# Altium schematic sheet Cell.SchDoc
size B; DocumentNumber: 6; SheetNumber: 6; SheetTotal: 14; PAGE_TITLE: -
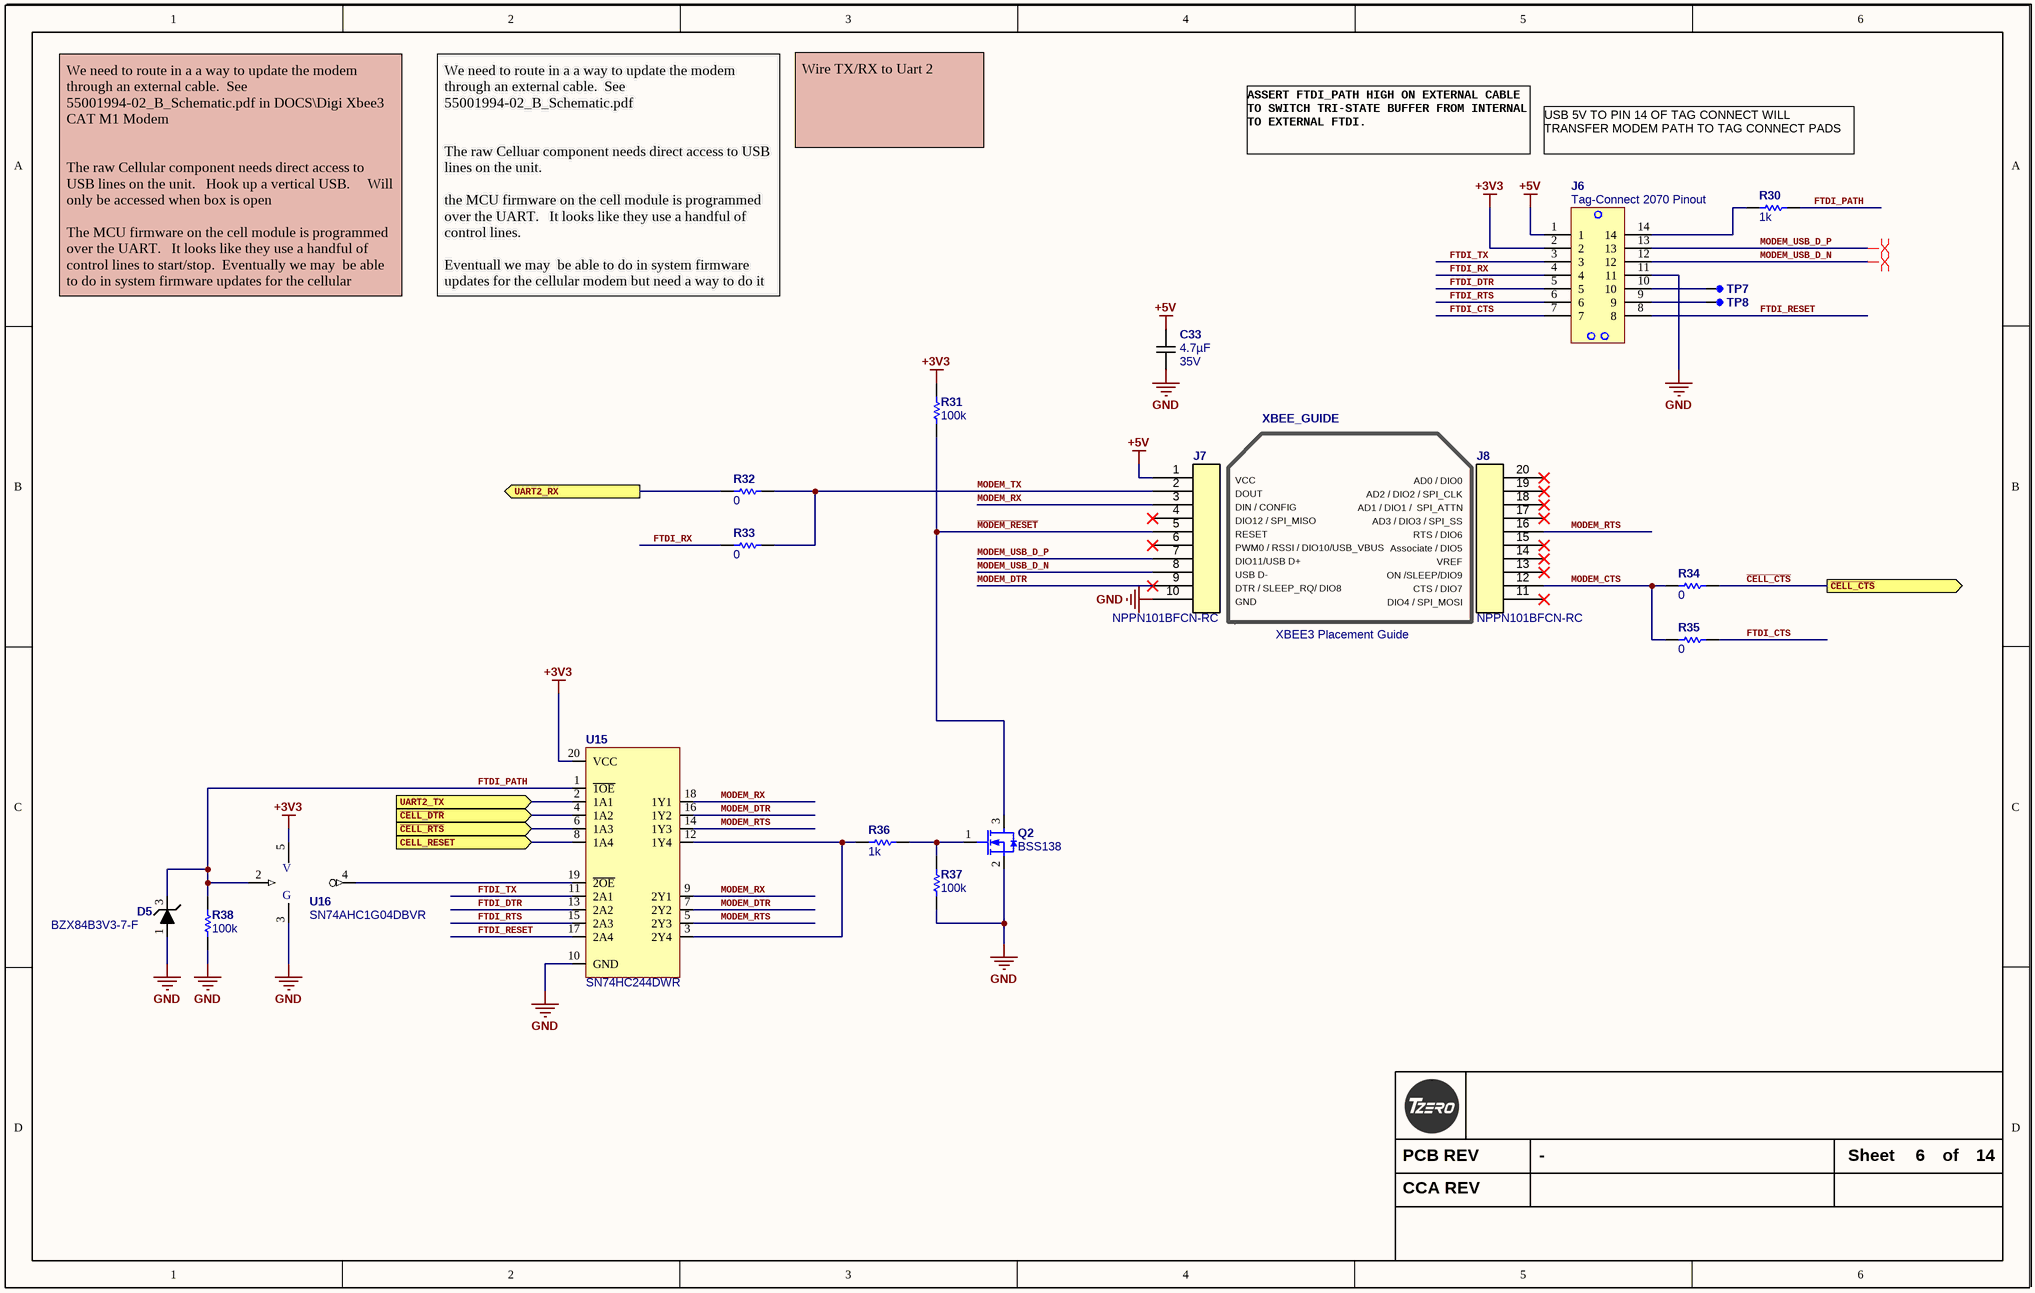
[diagram p0: Cell.SchDoc]

## Parts
C33  4.7µF  Voltage - Rated: 35V  [C0805_1.50MM_HD]
D5  BZX84B3V3-7-F  [D_SOT-23-3_P]
J6  Tag-Connect 2070 Pinout  [TC2070]  (no BOM)
J7  NPPN101BFCN-RC  [NPPN101BFCN-RC]
J8  NPPN101BFCN-RC  [NPPN101BFCN-RC - 11-20]
Q2  BSS138  [SOT23_Medium]
R30  1k  [R0603_0.55MM_MD]
R31  100k  [R0603_0.55MM_MD]
R32  0  [R0603_0.55MM_MD]
R33  0  [R0603_0.55MM_MD]
R34  0  [R0603_0.55MM_MD]
R35  0  [R0603_0.55MM_MD]
R36  1k  [R0603_0.55MM_MD]
R37  100k  [R0603_0.55MM_MD]
R38  100k  [R0603_0.55MM_MD]
TP7  (no value)  [TP_SMT_25_MIL_ROUND]  (net tie, no BOM)
TP8  (no value)  [TP_SMT_25_MIL_ROUND]  (net tie, no BOM)
U15  SN74HC244DWR  [SOIC-20-300_MEDIUM]
U16  SN74AHC1G04DBVR  [TSOT-23-5]
XBEE_GUIDE  XBEE3 Placement Guide  [XBEE3_CELLULAR_PLACEMENT_GUIDE]  (no BOM)

## Ports
CELL_RESET (in), UART2_RX (out), UART2_TX (in), ~{CELL_CTS} (out), ~{CELL_DTR} (in), ~{CELL_RTS} (in)

## Nets
+3V3: J6.2 R31.2 U15.20(VCC) U16.5(VCC)
+5V: C33.2 J6.1 J7.1
GND: C33.1 D5.1(A) J6.11 J7.10 Q2.2(S) R37.1 R38.1 U15.10(GND) U16.3(GND)
~{CELL_CTS}: R34.1 ; port ~{CELL_CTS}
~{CELL_DTR}: U15.4(1A2) ; port ~{CELL_DTR}
~{CELL_RTS}: U15.6(1A3) ; port ~{CELL_RTS}
~{MODEM_RESET}: J7.5 Q2.3(D) R31.1
CELL_RESET: U15.8(1A4) ; port CELL_RESET
FTDI_CTS: J6.7 R35.1
FTDI_DTR: J6.5 U15.13(2A2)
FTDI_PATH: D5.3(K) R30.1 R38.2 U15.1(~{1OE}) U16.2(A)
FTDI_RESET: J6.8 U15.17(2A4)
FTDI_RTS: J6.6 U15.15(2A3)
FTDI_RX: J6.4 R33.2
FTDI_TX: J6.3 U15.11(2A1)
MODEM_CTS: J8.12 R34.2 R35.2
MODEM_DTR: J7.9 U15.7(2Y2) U15.16(1Y2)
MODEM_RTS: J8.16 U15.5(2Y3) U15.14(1Y3)
MODEM_RX: J7.3 U15.9(2Y1) U15.18(1Y1)
MODEM_TX: J7.2 R32.1 R33.1
MODEM_USB_D_N: J6.12 J7.8
MODEM_USB_D_P: J6.13 J7.7
UART2_RX: R32.2 ; port UART2_RX
UART2_TX: U15.2(1A1) ; port UART2_TX
NetJ6_9: J6.9 TP8.1
NetJ6_10: J6.10 TP7.1
NetJ6_14: J6.14 R30.2
NetQ2_1: Q2.1(G) R36.1 R37.2
NetR36_2: R36.2 U15.3(2Y4) U15.12(1Y4)
NetU15_19: U15.19(~{2OE}) U16.4(Y)

Not connected (* = marked no-connect by the designer): J7 4* 6*; J8 11* 13* 14* 15* 17* 18* 19* 20*

## Layout directives
differential pair; differential pair class DIFF90: MODEM_USB_D_N, MODEM_USB_D_P

## Notes on the sheet
- Wire TX/RX to Uart 2
- ASSERT FTDI_PATH HIGH ON EXTERNAL CABLE TO SWITCH TRI-STATE BUFFER FROM INTERNAL TO EXTERNAL FTDI.
- USB 5V TO PIN 14 OF TAG CONNECT WILL TRANSFER MODEM PATH TO TAG CONNECT PADS
- We need to route in a a way to update the modem through an external cable.  See 55001994-02_B_Schematic.pdf in DOCS\Digi Xbee3 CAT M1 Modem
  The raw Cellular component needs direct access to USB lines on the unit.   Hook up a vertical USB.     Will only be accessed when box is open
  The MCU firmware on the cell module is programmed over the UART.   It looks like they use a handful of control lines to start/stop.  Eventually we may  be able to do in system firmware updates for the cellular modem but need a way to do it manually without pulling the modem out of the socket.   I would like to have some sort of "mux" that routes the UART and control signals to an external connector.    We could also put another FTDI chip on the PCB but it would rarely be used.    Can't use a stanard FTDI cable as we weel RTS,CTS and DTR.
- We need to route in a a way to update the modem through an external cable.  See 55001994-02_B_Schematic.pdf
  The raw Celluar component needs direct access to USB lines on the unit.
  the MCU firmware on the cell module is programmed over the UART.   It looks like they use a handful of control lines.
  Eventuall we may  be able to do in system firmware updates for the cellular modem but need a way to do it manually without pulling the modem out of the socket
- PCB REV
- Sheet
- of
- CCA REV
- (in symbol SN74AHC1G04DBVR) V; G
- (in symbol XBEE3_CELLULAR_PLACEMENT_GUIDE) AD0 / DIO0; VCC; AD2 / DIO2 / SPI_CLK; DOUT; AD1 / DIO1 /  SPI_ATTN; DIN / CONFIG; AD3 / DIO3 / SPI_SS; DIO12 / SPI_MISO; RTS / DIO6; RESET; Associate / DIO5; PWM0 / RSSI / DIO10/USB_VBUS; VREF; DIO11/USB D+; ON /SLEEP/DIO9; USB D-; CTS / DIO7; DTR / SLEEP_RQ/ DIO8; DIO4 / SPI_MOSI; GND

## Library data of the parts
C33 = CGA4J1X7R1V475K125AE: CAP CER 4.7UF 35V X7R 0805; Manufacturer: TDK Corporation; Tolerance: ±10%; Substitution Notes: 4.7µF , 35V , ±10% , X7R , -55°C ~ 125°C , AEC-Q200 , 0805; Value: 4.7µF; Temperature Coefficient: X7R; Manufacturer Part Number: CGA4J1X7R1V475K125AE; ComponentLink1Description: Datasheet (Internal); ComponentLink1URL: datasheets\TDK\mlcc_automotive_general_en.pdf; ComponentLink2Description: Datasheet (External); ComponentLink2URL: https://product.tdk.com/info/en/catalog/datasheets/mlcc_automotive_general_en.pdf; Supplier 1: Digikey; Supplier Part Number 1: 445-172479-1-ND; Category: Capacitors; Features: Soft Termination; Operating Temperature: -55°C ~ 125°C; Ratings: AEC-Q200; Package: 0805; Thickness (Max): 1.50MM
D5 = BZX84B3V3-7-F: DIODE ZENER 3.3V 300MW SOT23; Manufacturer: Diodes Inc; CategorySort: 400; Voltage - Forward (Vf) (Max) @ If: 900mV @ 10mA; Current - Reverse Leakage @ Vr: 5µA @ 1V; Tolerance: ±2%; Impedance (Max) (Zzt): 95 Ohm; Num Pins: 3; Diode Suffix: 1A_3C; Library Ref ARL: ARL_DZ_1A_3C; Category: Diodes; Value: BZX84B3V3-7-F; Manufacturer Part Number: BZX84B3V3-7-F; ComponentLink1Description: Internal Datasheet; ComponentLink1URL: http://www.diodes.com/datasheets/BZX84Bxx(x).pdf; ComponentLink2Description: External Datasheet; ComponentLink2URL: http://www.diodes.com/datasheets/BZX84Bxx(x).pdf; Stocked: 0; Supplier 1: Digi-Key; Supplier Part Number 1: BZX84B3V3-FDICT-ND; SortValue: BZX84B3V3-7-F; Pricing: 1 = 0.19  ;  10 = 0.177  ;  25 = 0.1612  ;  100 = 0.1159  ;  250 = 0.06824  ;  500 = 0.05662  ;  1000 = 0.03863 (USD); Sales Status: Active; Voltage - Zener (Nom) (Vz): 3.3V; Power - Max: 300mW; Mounting Type: Surface Mount; Package: TO-236-3- SC-59- SOT-23-3; Supplier Device Package: SOT-23-3; Packaging: Cut Tape (CT); Operating Temperature: -65°C ~ 150°C; MANUFACTURER_P_N: BZX84B3V3-7-F
J6 = TC2070
J7 = NPPN101BFCN-RC: CONN RECEPT 2MM SINGLE STR 10POS; Manufacturer: Sullins; Number of Positions: 10; Connector Type: Header,Socket; Current Rating: 1A; Gender: Female; Insulation Resistance: 5GR; Pitch: 0.079inch; Value: NPPN101BFCN-RC; Supplier 1: Digi-Key; Supplier Part Number 1: S5751-10-ND; Manufacturer Part Number: NPPN101BFCN-RC; RoHS: Yes; Stock: 72438; Pricing: 1 = 0.98000, 60 = 0.78033, 120 = 0.74650, 540 = 0.61074, 1020 = 0.54288, 5040 = 0.49010 (USD); Mount: Through Hole; Colour: Black; Contact Plating: Gold; Contact Material: Bronze; Material: Nylon; Min Operating Temperature: -40°C; Max Operating Temperature: 105°C; Package Quantity: 1000; Number of Rows: 1; Packaging: Bulk; Termination: Solder; Lead Free: Lead Free; ComponentLink1URL: https://drawings-pdf.s3.amazonaws.com/10483.pdf; ComponentLink1Description: https://drawings-pdf.s3.amazonaws.com/10483.pdf
J8 = NPPN101BFCN-RC_11-20: CONN RECEPT 2MM SINGLE STR 10POS; Manufacturer: Sullins; Number of Positions: 10; Connector Type: Header,Socket; Current Rating: 1A; Gender: Female; Insulation Resistance: 5GR; Pitch: 0.079inch; Value: NPPN101BFCN-RC; Supplier 1: Digi-Key; Supplier Part Number 1: S5751-10-ND; Manufacturer Part Number: NPPN101BFCN-RC; RoHS: Yes; Stock: 72438; Pricing: 1 = 0.98000, 60 = 0.78033, 120 = 0.74650, 540 = 0.61074, 1020 = 0.54288, 5040 = 0.49010 (USD); Mount: Through Hole; Colour: Black; Contact Plating: Gold; Contact Material: Bronze; Material: Nylon; Min Operating Temperature: -40°C; Max Operating Temperature: 105°C; Package Quantity: 1000; Number of Rows: 1; Packaging: Bulk; Termination: Solder; Lead Free: Lead Free; ComponentLink1URL: https://drawings-pdf.s3.amazonaws.com/10483.pdf; ComponentLink1Description: https://drawings-pdf.s3.amazonaws.com/10483.pdf
Q2 = BSS138: FAIRCHILD SEMICONDUCTOR - BSS138 - N CHANNEL MOSFET, 50V, 220mA SOT-23; CategorySort: 500; Value: BSS138; Sort Value: *; Category: Semiconductors; Supplier 1: Newark; Manufacturer: FAIRCHILD SEMICONDUCTOR; Manufacturer Part Number: BSS138; RoHS: YES; Stock 1: 17000; Pricing 1: 1=0.077, 25=0.064, 100=0.049, 250=0.039, 500=0.035, 1000=0.03 (USD); ComponentLink1URL: http://www.fairchildsemi.com/ds/BS/BSS138.pdf; ComponentLink1Description: http://www.fairchildsemi.com/ds/BS/BSS138.pdf; Supplier Part Number 1: 58K8769; Package: SOT-23
R30 R36 = ERJ-3EKF1001V: RES 1K OHM 1/10W 1% 0603 SMD; Manufacturer: Panasonic Electronic Components; Package Power: 0603  (0.1W); Power (Watts): 0.1W- 1/10W; Temperature Coefficient: ±100ppm/°C; Limiting Element Voltage: 75; Maximum Overload Voltage: 150; Maximum Working Voltage: 10.0V; Substitution Notes: 1k , ±1% , 0603 , AEC-Q200; Value: 1k; Manufacturer Part Number: ERJ-3EKF1001V; ComponentLink1Description: Internal Datasheet; ComponentLink1URL: datasheets\Panasonic Electronic Components\AOA0000CE2.pdf; ComponentLink2Description: External Datasheet; ComponentLink2URL: http://industrial.panasonic.com/www-data/pdf/AOA0000/AOA0000CE2.pdf; Supplier 1: Digi-Key; Supplier Part Number 1: P1.00KHCT-ND; Category: Resistors; Resistance (Ohms): 1k; Composition: Thick Film; Features: -; Tolerance: ±1%; Package: 0603 (1608 Metric); Supplier Package: 0603; Size / Dimension: 0.063" L x 0.031" W (1.60mm x 0.80mm); Height: 0.55MM; Number of Terminations: 2; Packaging: Cut Tape (CT); Sort Value: 1000; Sort Value Package: 603_1000; Ratings: AEC-Q200
R31 R37 R38 = ERJ-3EKF1003V: RES 100K OHM 1/10W 1% 0603 SMD; Manufacturer: Panasonic Electronic Components; Package Power: 0603  (0.1W); Power (Watts): 0.1W- 1/10W; Temperature Coefficient: ±100ppm/°C; Limiting Element Voltage: 75; Maximum Overload Voltage: 150; Maximum Working Voltage: 75.0V; Substitution Notes: 100k , ±1% , 0603 , AEC-Q200; Value: 100k; Manufacturer Part Number: ERJ-3EKF1003V; ComponentLink1Description: Internal Datasheet; ComponentLink1URL: datasheets\Panasonic Electronic Components\AOA0000CE2.pdf; ComponentLink2Description: External Datasheet; ComponentLink2URL: http://industrial.panasonic.com/www-data/pdf/AOA0000/AOA0000CE2.pdf; Supplier 1: Digi-Key; Supplier Part Number 1: P100KHCT-ND; Category: Resistors; Resistance (Ohms): 100k; Composition: Thick Film; Features: -; Tolerance: ±1%; Package: 0603 (1608 Metric); Supplier Package: 0603; Size / Dimension: 0.063" L x 0.031" W (1.60mm x 0.80mm); Height: 0.55MM; Number of Terminations: 2; Packaging: Cut Tape (CT); Sort Value: 100000; Sort Value Package: 603_100000; Ratings: AEC-Q200
R32-R35 = ERJ-3GEY0R00V: RES 0.0 OHM 1/10W JUMP 0603 SMD; Manufacturer: Panasonic Electronic Components; Package Power: 0603  (0.1W); Power (Watts): 0.1W- 1/10W; Tolerance: Jumper; Limiting Element Voltage: 75; Maximum Overload Voltage: 150; Maximum Working Voltage: 0.0V; Substitution Notes: 0 , Jumper , 0603 , AEC-Q200; Value: 0; Manufacturer Part Number: ERJ-3GEY0R00V; ComponentLink1Description: Internal Datasheet; ComponentLink1URL: datasheets\Panasonic Electronic Components\AOA0000CE1.pdf; ComponentLink2Description: External Datasheet; ComponentLink2URL: http://industrial.panasonic.com/www-data/pdf/AOA0000/AOA0000CE1.pdf; Supplier 1: Digi-Key; Supplier Part Number 1: P0.0GCT-ND; Category: Resistors; Resistance (Ohms): 0; Composition: Thick Film; Features: -; Temperature Coefficient: -; Package: 0603 (1608 Metric); Supplier Package: 0603; Size / Dimension: 0.063" L x 0.031" W (1.60mm x 0.80mm); Height: 0.55MM; Number of Terminations: 2; Sort Value: 0; Sort Value Package: 603_0; Ratings: AEC-Q200
TP7 TP8 = TP SMT 25MIL: Sort Value: *; Category: *; CategorySort: *
U15 = SN74HC244DWR: IC BUFF/DVR TRI-ST DUAL 20SOIC; Manufacturer: Texas Instruments; CategorySort: 600; Logic Type: Buffer/Line Driver, Non-Inverting; Number of Elements: 2; Number of Bits per Element: 4; Current - Output High, Low: 7.8mA, 7.8mA; Voltage - Supply: 2 V ~ 6 V; Value: SN74HC244DWR; Sort Value: *; Category: Integrated Circuits; Supplier 1: Digi-Key; Manufacturer Part Number: SN74HC244DWR; RoHS: RoHS Compliant; Stock 1: 40951; Pricing 1: 1=0.58, 25=0.4044, 100=0.3465, 250=0.29924, 500=0.25726, 1000=0.1995 (USD); Operating Temperature: -40°C ~ 85°C; Mounting Type: Surface Mount; Package: 20-SOIC (0.300", 7.50mm Width); Packaging: Cut Tape (CT); Supplier Device Package: 20-SOIC; ComponentLink1URL: http://focus.ti.com/lit/ds/symlink/sn74hc244.pdf; ComponentLink1Description: http://focus.ti.com/lit/ds/symlink/sn74hc244.pdf; Supplier Part Number 1: 296-1196-1-ND
U16 = SN74AHC1G04DBVR: IC SINGLE INVERTER GATE SOT23-5; Manufacturer: Texas Instruments; CategorySort: 600; Number of Inputs: 1; Current - Output High, Low: 8mA, 8mA; Voltage - Supply: 2 V ~ 5.5 V; Value: SN74AHC1G04DBVR; Sort Value: *; Category: Integrated Circuits; Supplier 1: Digi-Key; Supplier Part Number 1: 296-1089-1-ND; Manufacturer Part Number: SN74AHC1G04DBVR; RoHS: RoHS Compliant; Stock 1: 45111; Pricing 1: 1=0.53, 25=0.31, 100=0.25, 250=0.18, 500=0.145, 1000=0.1125 (USD); Logic Type: Inverter; Number of Circuits: 1; Operating Temperature: -40°C ~ 85°C; Mounting Type: Surface Mount; Package: SC-74A, SOT-753; Supplier Device Package: SOT-23-5; Packaging: Cut Tape (CT); ComponentLink1URL: http://focus.ti.com/lit/ds/symlink/sn74ahc1g04.pdf; ComponentLink1Description: http://focus.ti.com/lit/ds/symlink/sn74ahc1g04.pdf
XBEE_GUIDE = XBEE3_CELLULAR_PLACEMENT_GUIDE: Value: XBEE3 Placement Guide